# Altium schematic sheet KS_DAP_WL.SchDoc
size A4
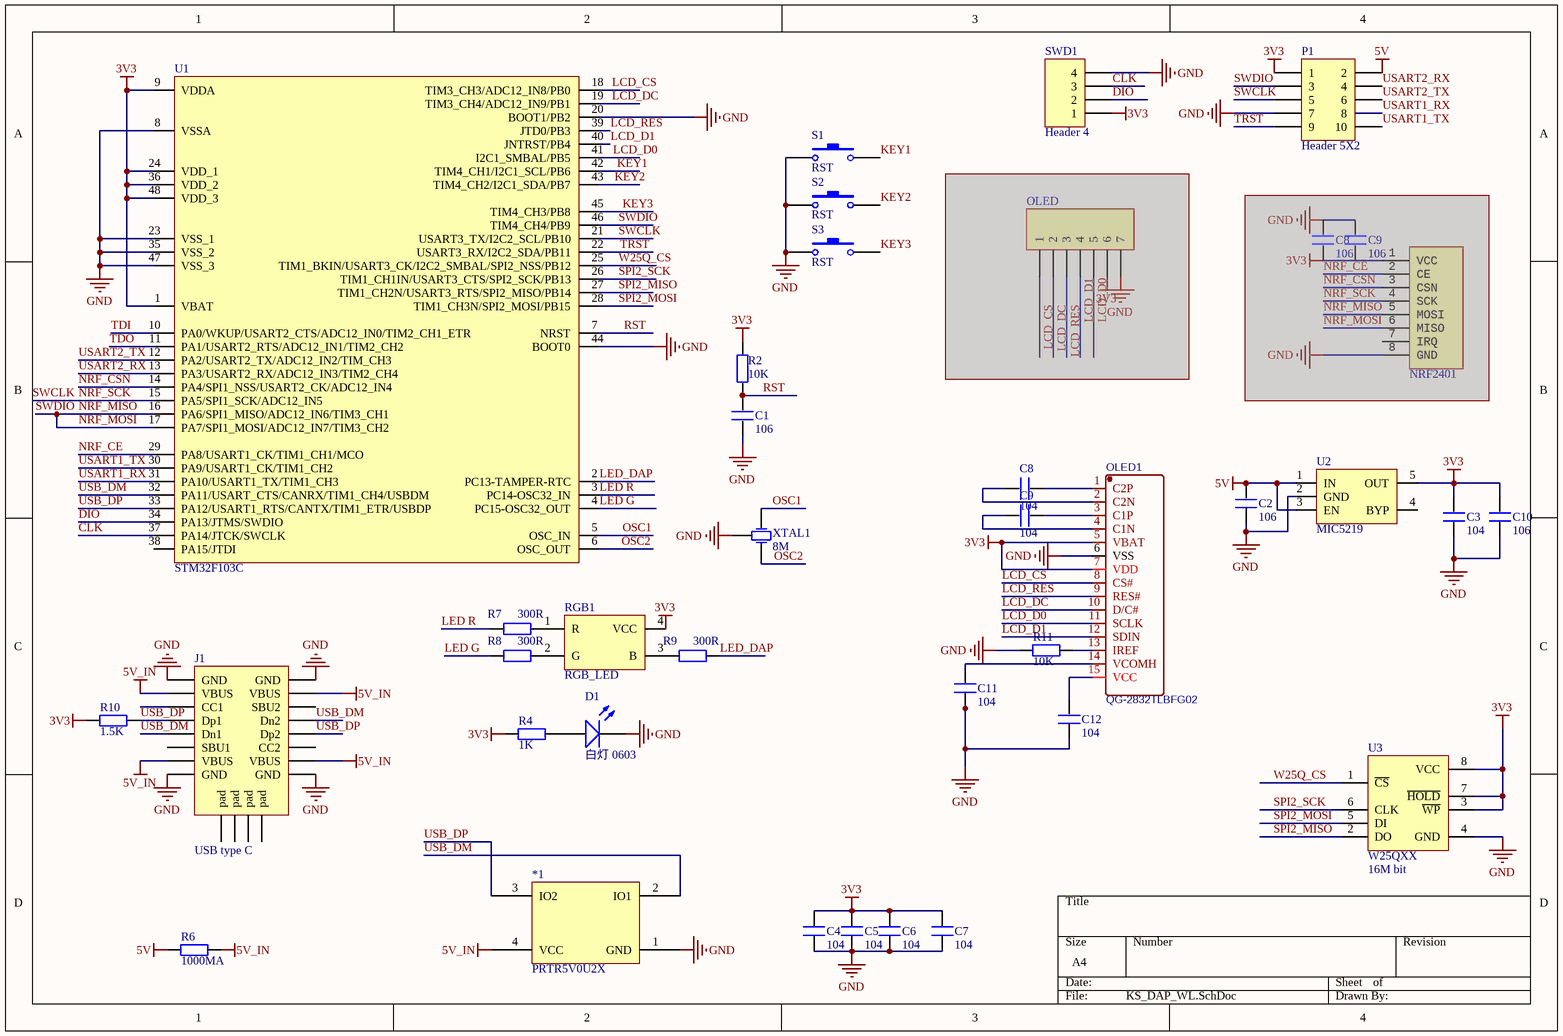
[diagram p0: KS_DAP_WL.SchDoc]

## Parts
(Parts that share a designator on the sheet are numbered #1, #2 ... from top to bottom, then left to right.)
*1  PRTR5V0U2X  [LC-SOT-143]
C1  106  [0603_C]
C2  106  [0805_C]
C3  value 104  [0603_C]  (hidden comment: 106)
C4  value 104  [0603_C]  (hidden comment: 106)
C5  value 104  [0603_C]  (hidden comment: 106)
C6  value 104  [0603_C]  (hidden comment: 106)
C7  value 104  [0603_C]  (hidden comment: 106)
C8#1  106  [0805_C]  (masked out: inside a compile mask, not in the netlist)
C8#2  value 104  [0603_C]  (hidden comment: 106)
C9#1  106  [0805_C]  (masked out: inside a compile mask, not in the netlist)
C9#2  value 104  [0603_C]  (hidden comment: 106)
C10  106  [0603_C]
C11  value 104  [0603_C]  (hidden comment: 106)
C12  value 104  [0603_C]  (hidden comment: 106)
D1  白灯 0603  [0603_LED_S1]
J1  USB type C  [USB Type-C-16Pin_A]
NRF2401  nRF24L01P_PA_LNA  [NRF24L01P_PA_LNA]  (value not drawn)  (masked out: inside a compile mask, not in the netlist)
OLED  Header 7  [HDR2.54-LI-7P]  (value not drawn)  (masked out: inside a compile mask, not in the netlist)
OLED1  QG-2832TLBFG02  [0.91-OLED]
P1  Header 5X2  [300S-2*5P 2.54MM_2]
R2  value 10K  [0603_R]  (hidden comment: Res2)
R4  value 1K  [0603_R]  (hidden comment: Res2)
R6  value 1000MA  [0805_L]  (hidden comment: 1A保险丝)
R7  value 300R  [0603_R]  (hidden comment: 1K)
R8  value 300R  [0603_R]  (hidden comment: 1K)
R9  value 300R  [0603_R]  (hidden comment: 1K)
R10  value 1.5K  [LC-0603_R]  (hidden comment: Res2)
R11  value 10K  [0603_R]  (hidden comment: Res2)
RGB1  RGB_LED  [LED_3528_RGB]
S1  RST  [KEY]
S2  RST  [KEY]
S3  RST  [KEY]
SWD1  Header 4  [HDR1.27-LI-4P]
U1  STM32F103C  [LQFP48 7X7_N]
U2  MIC5219  [SOT23-5N]
U3  W25QXX  Memory: 16M bit  [SOP8W_N]
XTAL1  8M  [XTAL-3215-3P]

## Nets
3V3: C3.2 C4.2 C5.2 C6.2 C7.2 C10.2 OLED1.5(VBAT) OLED1.7(VDD) P1.1 R2.2 R4.2 R10.1 RGB1.4(VCC) SWD1.1 U1.1(VBAT) U1.9(VDDA) U1.24(VDD_1) U1.36(VDD_2) U1.48(VDD_3) U2.5(OUT) U3.3(~{WP}) U3.7(~{HOLD}) U3.8(VCC)
5V: C2.2 P1.2 R6.1 U2.1(IN) U2.3(EN)
5V_IN: *1.4(VCC) J1.A4(VBUS) J1.A9(VBUS) J1.B4(VBUS) J1.B9(VBUS) R6.2
GND: *1.1(GND) C1.1 C2.1 C3.1 C4.1 C5.1 C6.1 C7.1 C10.1 C11.1 C12.1 D1.K J1.A1(GND) J1.A12(GND) J1.B1(GND) J1.B12(GND) OLED1.6(VSS) P1.7 R11.2 S1.1 S2.1 S3.1 SWD1.4 U1.8(VSSA) U1.20(BOOT1/PB2) U1.23(VSS_1) U1.35(VSS_2) U1.44(BOOT0) U1.47(VSS_3) U2.2(GND) U3.4(GND) XTAL1.3
CLK: SWD1.3 U1.37(PA14/JTCK/SWCLK)
DIO: SWD1.2 U1.34(PA13/JTMS/SWDIO)
KEY1: S1.2 U1.42(TIM4_CH1/I2C1_SCL/PB6)
KEY2: S2.2 U1.43(TIM4_CH2/I2C1_SDA/PB7)
KEY3: S3.2 U1.45(TIM4_CH3/PB8)
LCD_CS: OLED1.8(CS#) U1.18(TIM3_CH3/ADC12_IN8/PB0)
LCD_D0: OLED1.11(SCLK) U1.41(I2C1_SMBAL/PB5)
LCD_D1: OLED1.12(SDIN) U1.40(JNTRST/PB4)
LCD_DC: OLED1.10(D/C#) U1.19(TIM3_CH4/ADC12_IN9/PB1)
LCD_RES: OLED1.9(RES#) U1.39(JTD0/PB3)
LED G: R8.1 U1.4(PC15-OSC32_OUT)
LED R: R7.1 U1.3(PC14-OSC32_IN)
LED_DAP: R9.2 U1.2(PC13-TAMPER-RTC)
NRF_CE: U1.29(PA8/USART1_CK/TIM1_CH1/MCO)
NRF_CSN: U1.14(PA4/SPI1_NSS/USART2_CK/ADC12_IN4)
NRF_MISO: P1.3 U1.16(PA6/SPI1_MISO/ADC12_IN6/TIM3_CH1) U1.17(PA7/SPI1_MOSI/ADC12_IN7/TIM3_CH2) U1.46(TIM4_CH4/PB9)  [also labelled NRF_MOSI, SWDIO]
NRF_SCK: P1.5 U1.15(PA5/SPI1_SCK/ADC12_IN5) U1.21(USART3_TX/I2C2_SCL/PB10)  [also labelled SWCLK]
OSC1: U1.5(OSC_IN) XTAL1.1
OSC2: U1.6(OSC_OUT) XTAL1.2
RST: C1.2 R2.1 U1.7(NRST)
SPI2_MISO: U1.27(TIM1_CH2N/USART3_RTS/SPI2_MISO/PB14) U3.2(DO)
SPI2_MOSI: U1.28(TIM1_CH3N/SPI2_MOSI/PB15) U3.5(DI)
SPI2_SCK: U1.26(TIM1_CH1IN/USART3_CTS/SPI2_SCK/PB13) U3.6(CLK)
TDI: U1.10(PA0/WKUP/USART2_CTS/ADC12_IN0/TIM2_CH1_ETR)
TDO: U1.11(PA1/USART2_RTS/ADC12_IN1/TIM2_CH2)
TRST: P1.9 U1.22(USART3_RX/I2C2_SDA/PB11)
USART1_RX: P1.8 U1.31(PA10/USART1_TX/TIM1_CH3)
USART1_TX: P1.10 U1.30(PA9/USART1_CK/TIM1_CH2)
USART2_RX: P1.4 U1.13(PA3/USART2_RX/ADC12_IN3/TIM2_CH4)
USART2_TX: P1.6 U1.12(PA2/USART2_TX/ADC12_IN2/TIM_CH3)
USB_DM: *1.2(IO1) J1.A7(Dn1) J1.B7(Dn2) U1.32(PA11/USART_CTS/CANRX/TIM1_CH4/USBDM)
USB_DP: *1.3(IO2) J1.A6(Dp1) J1.B6(Dp2) R10.2 U1.33(PA12/USART1_RTS/CANTX/TIM1_ETR/USBDP)
W25Q_CS: U1.25(TIM1_BKIN/USART3_CK/I2C2_SMBAL/SPI2_NSS/PB12) U3.1(~{CS})
NetC8#2_1: C8#2.1 OLED1.1(C2P)
NetC8#2_2: C8#2.2 OLED1.2(C2N)
NetC9#2_1: C9#2.1 OLED1.3(C1P)
NetC9#2_2: C9#2.2 OLED1.4(C1N)
NetC11_2: C11.2 OLED1.14(VCOMH)
NetC12_2: C12.2 OLED1.15(VCC)
NetD1_A: D1.A R4.1
NetOLED1_13: OLED1.13(IREF) R11.1
NetR7_2: R7.2 RGB1.1(R)
NetR8_2: R8.2 RGB1.2(G)
NetR9_1: R9.1 RGB1.3(B)

Not connected (* = marked no-connect by the designer): J1 0(pad) A5(CC1) A8(SBU1) B5(CC2) B8(SBU2); U1 38(PA15/JTDI); U2 4(BYP)

## Library data of the parts
C1-C7 C8#1 C8#2 C9#1 C9#2 C10-C12 = C_1
  C1 C2 C8#1 C9#1 C10: value: 106
D1 = 0603 白灯: 发光二极管; ComponentLink1Description: 供应商链接; ComponentLink1URL: http://www.szlcsc.com/product/details_2663.html; Package: 0603; Supplier: LC; SuppliersPartNumber: C2290
J1 = USB_C
NRF2401 = nRF24L01P_PA_LNA: Module
OLED = Header 7: Header, 7-Pin; LatestRevisionDate: 17-Jul-2002; LatestRevisionNote: Re-released for DXP Platform.; Publisher: Altium Limited
OLED1 = 0.91-OLED: BOM_Manufacturer: Allvision; Contributor: LCSC; BOM_Supplier: LCSC; BOM_Manufacturer Part: QG-2832TLBFG02; BOM_Supplier Part: C91220; spicePre: O; spiceSymbolName: QG-2832TLBFG02
P1 = Header 5X2: Header, 5-Pin, Dual row; LatestRevisionDate: 17-Jul-2002; LatestRevisionNote: Re-released for DXP Platform.; Publisher: Altium Limited
R2 R4 R6-R11 = Res2: Resistor; Published: 8-Jun-2000; LatestRevisionDate: 17-Jul-2002; LatestRevisionNote: Re-released for DXP Platform.; PackageReference: AXIAL-0.4; Publisher: Altium Limited
RGB1 = RGB_LED: 三色高亮LED
S1-S3 = SW-PB: Switch; Published: 24-Mar-1999; LatestRevisionDate: 17-Jul-2002; LatestRevisionNote: Re-released for DXP Platform.; PackageReference: SPST-2; Publisher: Altium Limited; PackageDescription: Switch; 2 Leads
SWD1 = Header 4: Header, 4-Pin; LatestRevisionDate: 17-Jul-2002; LatestRevisionNote: Re-released for DXP Platform.; Publisher: Altium Limited
U2 = MIC5219: 3.3V 降压芯片
U3 = W25QXX: SPI FLASH
XTAL1 = XTAL1